# Altium schematic sheet ToF.SchDoc: My title
size A3; Organization: University of California; Address1: 475 Portola Plaza; Address2: Los Angeles, CA 90095; Revision: R01; SheetNumber: 1; SheetTotal: 1
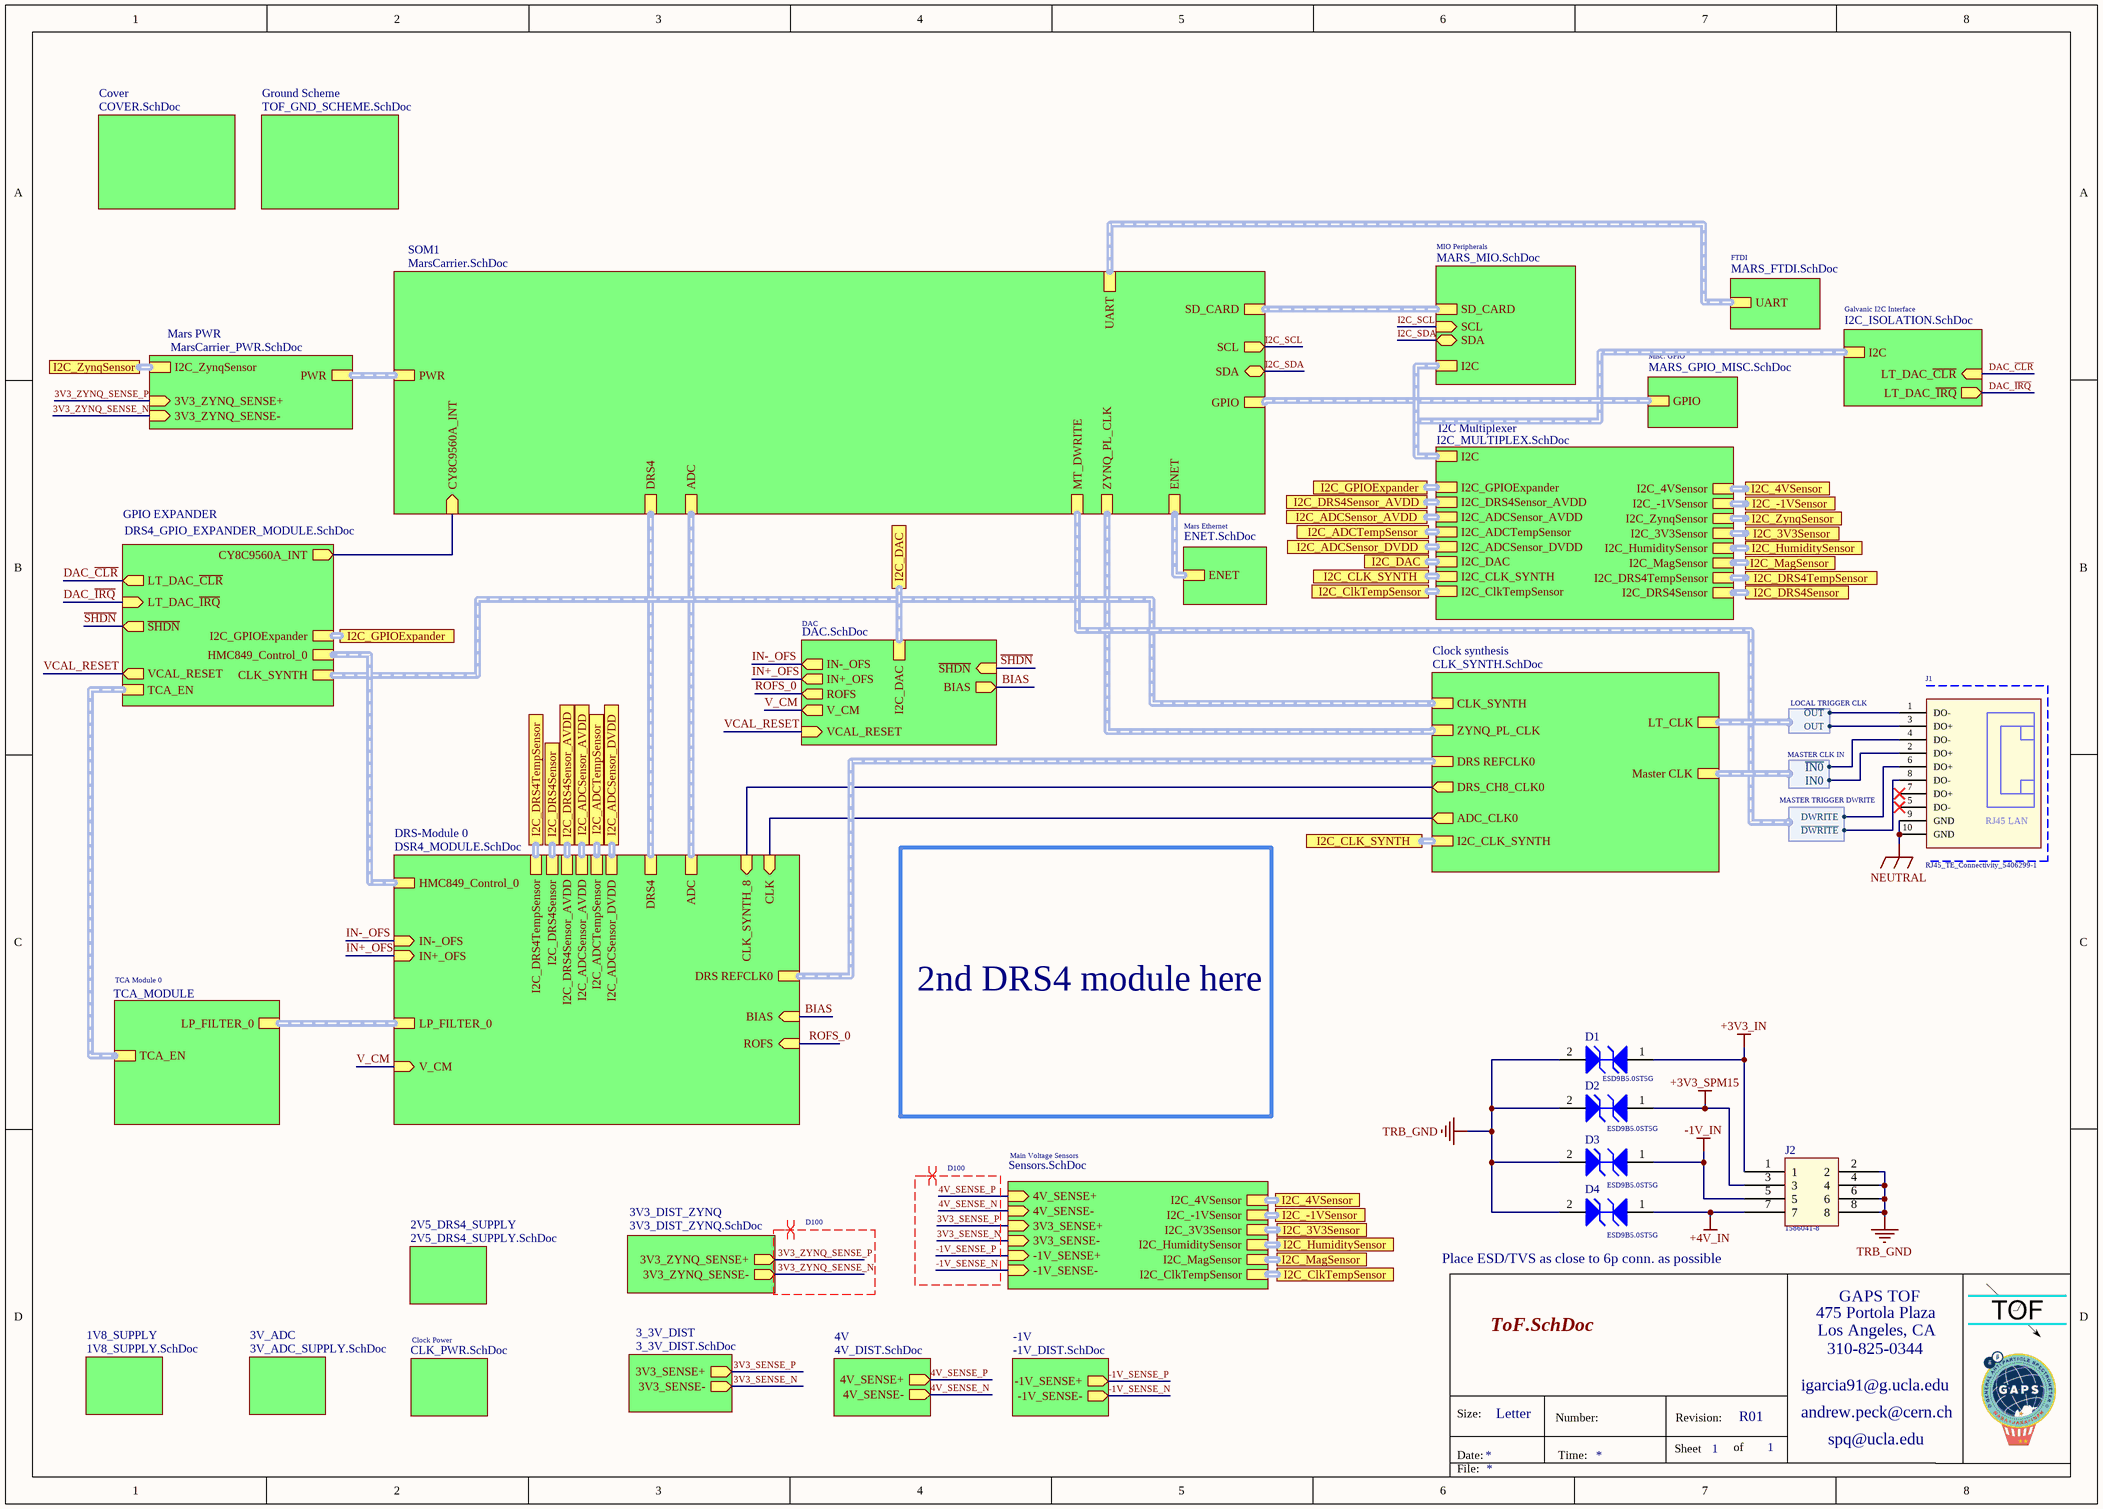
[diagram p0: ToF.SchDoc]

## Parts
D1  ESD9B5.0ST5G  [ONSC-SOD-923-2-514AB-01_V]
D2  ESD9B5.0ST5G  [ONSC-SOD-923-2-514AB-01_V]
D3  ESD9B5.0ST5G  [ONSC-SOD-923-2-514AB-01_V]
D4  ESD9B5.0ST5G  [ONSC-SOD-923-2-514AB-01_V]
J1  RJ45_TE_Connectivity_5406299-1  [RJ45_TE_Connectivity_5406299-1]
J2  Series: 1586041-8  [Header_TE_Connectivity_1586041-8_8POS]  (hidden comment: Header_TE_Connectivity_1586041-8_8POS)

## Sub-sheets
1V8_SUPPLY = 1V8_SUPPLY.SchDoc: no entries
2V5_DRS4_SUPPLY = 2V5_DRS4_SUPPLY.SchDoc: no entries
3_3V_DIST = 3_3V_DIST.SchDoc: 3V3_SENSE- (out), 3V3_SENSE+ (out)
3V3_DIST_ZYNQ = 3V3_DIST_ZYNQ.SchDoc: 3V3_ZYNQ_SENSE- (out), 3V3_ZYNQ_SENSE+ (out)
3V_ADC = 3V_ADC_SUPPLY.SchDoc: no entries
4V = 4V_DIST.SchDoc: 4V_SENSE- (out), 4V_SENSE+ (out)
-1V = -1V_DIST.SchDoc: -1V_SENSE- (out), -1V_SENSE+ (out)
Clock Power = CLK_PWR.SchDoc: no entries
Clock synthesis = CLK_SYNTH.SchDoc: CLK_SYNTH (harness CLK SYNTH CONTROL), ZYNQ_PL_CLK (harness ZYNQ PL CLK), DRS REFCLK0 (harness DRS4 REFCLK0), DRS_CH8_CLK0 (out), Master CLK (harness MASTER CLK IN), ADC_CLK0 (out), I2C_CLK_SYNTH (harness Clock Synth I2C), LT_CLK (harness LOCAL TRIGGER CLK)
Cover = COVER.SchDoc: no entries
DAC = DAC.SchDoc: I2C_DAC (harness DAC  I2C), IN-_OFS (out), IN+_OFS (out), ROFS (out), V_CM (out), VCAL_RESET (in), ~{SHDN} (in), BIAS (out)
DRS-Module 0 = DSR4_MODULE.SchDoc: ADC (harness ADC), DRS4 (harness DRS4), DRS REFCLK0 (harness DRS4 REFCLK 0), BIAS (in), ROFS (in), HMC849_Control_0 (harness HMC849 Control 0), LP_FILTER_0 (harness TCA Filter 0), V_CM (in), CLK_SYNTH_8 (in), IN-_OFS (in), IN+_OFS (in), CLK (in), I2C_DRS4TempSensor (harness Clk Synth Temp Sensor I2C), I2C_DRS4Sensor (harness DRS4 Current Sensor I2C), I2C_DRS4Sensor_AVDD (harness DRS4 Current Sensor I2C), I2C_ADCSensor_AVDD (harness ADC AVDD Current Sensor I2C), I2C_ADCTempSensor (harness ADC Temp Sensor I2C), I2C_ADCSensor_DVDD (harness ADC DVDD Current Sensor I2C)
FTDI = MARS_FTDI.SchDoc: UART (harness Mars UART)
Galvanic I2C Interface = I2C_ISOLATION.SchDoc: I2C (harness Mars I2C), LT_DAC_~{CLR} (in), LT_DAC_~{IRQ} (out)
GPIO EXPANDER = DRS4_GPIO_EXPANDER_MODULE.SchDoc: HMC849_Control_0 (harness HMC849 Control 0), CLK_SYNTH (harness CLK SYNTH CONTROL), TCA_EN (harness TCA EN), ~{SHDN} (out), VCAL_RESET (out), LT_DAC_~{CLR} (out), LT_DAC_~{IRQ} (in), CY8C9560A_INT (out), I2C_GPIOExpander (harness GPIO Expander I2C)
Ground Scheme = TOF_GND_SCHEME.SchDoc: no entries
I2C Multiplexer = I2C_MULTIPLEX.SchDoc: I2C (harness Mars I2C), I2C_4VSensor (harness 4V Current Sensor I2C), I2C_-1VSensor (harness -1V Current Sensor I2C), I2C_ZynqSensor (harness 3V3 Zynq Current Sensor I2C), I2C_3V3Sensor (harness 3V3 Current Sensor I2C), I2C_HumiditySensor (harness Humidity Sensor I2C), I2C_MagSensor (harness Magnetic Field Sensor I2C), I2C_DRS4TempSensor (harness DRS4 Temp Sensor I2C), I2C_DRS4Sensor (harness DRS4 Temp Sensor I2C), I2C_GPIOExpander (harness GPIO Expander I2C), I2C_DRS4Sensor_AVDD (harness DRS4 Current Sensor I2C), I2C_ADCSensor_AVDD (harness ADC AVDD Current Sensor I2C), I2C_ADCTempSensor (harness ADC Temp Sensor I2C), I2C_ADCSensor_DVDD (harness ADC DVDD Current Sensor I2C), I2C_DAC (harness DAC  I2C), I2C_CLK_SYNTH (harness Clock Synth I2C), I2C_ClkTempSensor (harness Clk Synth Temp Sensor I2C)
Main Voltage Sensors = Sensors.SchDoc: -1V_SENSE- (in), -1V_SENSE+ (in), 4V_SENSE- (in), 4V_SENSE+ (in), 3V3_SENSE- (in), 3V3_SENSE+ (in), I2C_4VSensor (harness 4V Current Sensor I2C), I2C_-1VSensor (harness -1V Current Sensor I2C), I2C_3V3Sensor (harness -1V Current Sensor I2C), I2C_HumiditySensor (harness -1V Current Sensor I2C), I2C_MagSensor (harness -1V Current Sensor I2C), I2C_ClkTempSensor (harness Clk Synth Temp Sensor I2C)
Mars Ethernet = ENET.SchDoc: ENET (harness Mars ENET)
Mars PWR = MarsCarrier_PWR.SchDoc: PWR (harness Mars Power), 3V3_ZYNQ_SENSE- (in), 3V3_ZYNQ_SENSE+ (in), I2C_ZynqSensor (harness -1V Current Sensor I2C)
MIO Peripherals = MARS_MIO.SchDoc: SD_CARD (harness Mars SD Card), SCL (in), SDA (bidir), I2C (harness Mars I2C)
Misc. GPIO = MARS_GPIO_MISC.SchDoc: GPIO (harness Misc. I/O)
SOM1 = MarsCarrier.SchDoc: ADC (harness ADC), DRS4 (harness DRS4), ZYNQ_PL_CLK (harness ZYNQ PL CLK), ENET (harness Mars ENET), SD_CARD (harness Mars SD Card), SCL (out), SDA (bidir), PWR (harness Mars Power), GPIO (harness Misc. I/O), UART (harness Mars UART), CY8C9560A_INT (in), MT_DWRITE (harness MASTER TRIGGER DWRITE)
TCA Module 0 = TCA_MODULE: LP_FILTER_0 (harness TCA Filter 0), TCA_EN (harness TCA EN)

## Ports
I2C_3V3Sensor (harness 3V3 Current Sensor I2C), I2C_4VSensor (harness 4V Current Sensor I2C), I2C_-1VSensor (harness -1V Current Sensor I2C), I2C_ADCSensor_AVDD (harness ADC AVDD Current Sensor I2C), I2C_ADCSensor_DVDD (harness ADC DVDD Current Sensor I2C), I2C_ADCTempSensor (harness ADC Temp Sensor I2C), I2C_CLK_SYNTH (harness Clock Synth I2C), I2C_ClkTempSensor (harness Clk Synth Temp Sensor I2C), I2C_DAC (harness DAC  I2C), I2C_DRS4Sensor (harness DRS4 Current Sensor I2C), I2C_DRS4Sensor_AVDD (harness DRS4 AVDD Current Sensor I2C), I2C_DRS4TempSensor (harness DRS4 Temp Sensor I2C), I2C_GPIOExpander (harness GPIO Expander I2C), I2C_HumiditySensor (harness Humidity Sensor I2C), I2C_MagSensor (harness Magnetic Field Sensor I2C), I2C_ZynqSensor (harness 3V3 Zynq Current Sensor I2C)

## Harnesses
MASTER CLK IN: IN0, ~{IN0}
LOCAL TRIGGER CLK: OUT, ~{OUT}
MASTER TRIGGER DWRITE: DWRITE, ~{DWRITE}

## Nets
+3V3_IN: D1.1(A1) J2.1
+3V3_SPM15: D2.1(A1) J2.3
+4V_IN: D4.1(A1) J2.7
-1V_IN: D3.1(A1) J2.5
NEUTRAL: J1.9(GND) J1.10(GND)
TRB_GND: D1.2(A2) D2.2(A2) D3.2(A2) D4.2(A2) J2.2 J2.4 J2.6 J2.8
3V3_SENSE_N: sheet 3_3V_DIST/3V3_SENSE-, sheet Main Voltage Sensors/3V3_SENSE-
3V3_SENSE_P: sheet 3_3V_DIST/3V3_SENSE+, sheet Main Voltage Sensors/3V3_SENSE+
3V3_ZYNQ_SENSE_N: sheet Mars PWR/3V3_ZYNQ_SENSE-, sheet 3V3_DIST_ZYNQ/3V3_ZYNQ_SENSE-
3V3_ZYNQ_SENSE_P: sheet Mars PWR/3V3_ZYNQ_SENSE+, sheet 3V3_DIST_ZYNQ/3V3_ZYNQ_SENSE+
4V_SENSE_N: sheet 4V/4V_SENSE-, sheet Main Voltage Sensors/4V_SENSE-
4V_SENSE_P: sheet 4V/4V_SENSE+, sheet Main Voltage Sensors/4V_SENSE+
-1V_SENSE_N: sheet -1V/-1V_SENSE-, sheet Main Voltage Sensors/-1V_SENSE-
-1V_SENSE_P: sheet -1V/-1V_SENSE+, sheet Main Voltage Sensors/-1V_SENSE+
BIAS: sheet DRS-Module 0/BIAS, sheet DAC/BIAS
DAC_~{CLR}: sheet GPIO EXPANDER/LT_DAC_~{CLR}, sheet Galvanic I2C Interface/LT_DAC_~{CLR}
DAC_~{IRQ}: sheet GPIO EXPANDER/LT_DAC_~{IRQ}, sheet Galvanic I2C Interface/LT_DAC_~{IRQ}
I2C_SCL: sheet SOM1/SCL, sheet MIO Peripherals/SCL
I2C_SDA: sheet SOM1/SDA, sheet MIO Peripherals/SDA
IN+_OFS: sheet DRS-Module 0/IN+_OFS, sheet DAC/IN+_OFS
IN-_OFS: sheet DRS-Module 0/IN-_OFS, sheet DAC/IN-_OFS
ROFS_0: sheet DRS-Module 0/ROFS, sheet DAC/ROFS
~{SHDN}: sheet DAC/~{SHDN}, sheet GPIO EXPANDER/~{SHDN}
V_CM: sheet DRS-Module 0/V_CM, sheet DAC/V_CM
VCAL_RESET: sheet DAC/VCAL_RESET, sheet GPIO EXPANDER/VCAL_RESET
NetJ1_1: J1.1(DO-) ; sheet Clock synthesis/LT_CLK.~{OUT}
NetJ1_2: J1.2(DO+) ; sheet Clock synthesis/Master CLK.IN0
NetJ1_3: J1.3(DO+) ; sheet Clock synthesis/LT_CLK.OUT
NetJ1_4: J1.4(DO-) ; sheet Clock synthesis/Master CLK.~{IN0}
NetJ1_6: J1.6(DO+) ; sheet SOM1/MT_DWRITE.DWRITE
NetJ1_8: J1.8(DO-) ; sheet SOM1/MT_DWRITE.~{DWRITE}
(unnamed): sheet DRS-Module 0/CLK_SYNTH_8, sheet Clock synthesis/DRS_CH8_CLK0
(unnamed): sheet DRS-Module 0/CLK, sheet Clock synthesis/ADC_CLK0
(unnamed): sheet SOM1/CY8C9560A_INT, sheet GPIO EXPANDER/CY8C9560A_INT

Not connected (* = marked no-connect by the designer): J1 5(DO-)* 7(DO+)*

## Buses and harness runs
harness port I2C_3V3Sensor = sheet I2C Multiplexer/I2C_3V3Sensor
harness port I2C_3V3Sensor = sheet Main Voltage Sensors/I2C_3V3Sensor
harness port I2C_4VSensor = sheet I2C Multiplexer/I2C_4VSensor
harness port I2C_4VSensor = sheet Main Voltage Sensors/I2C_4VSensor
harness port I2C_-1VSensor = sheet I2C Multiplexer/I2C_-1VSensor
harness port I2C_-1VSensor = sheet Main Voltage Sensors/I2C_-1VSensor
harness port I2C_ADCSensor_AVDD = sheet DRS-Module 0/I2C_ADCSensor_AVDD
harness port I2C_ADCSensor_AVDD = sheet I2C Multiplexer/I2C_ADCSensor_AVDD
harness port I2C_ADCSensor_DVDD = sheet DRS-Module 0/I2C_ADCSensor_DVDD
harness port I2C_ADCSensor_DVDD = sheet I2C Multiplexer/I2C_ADCSensor_DVDD
harness port I2C_ADCTempSensor = sheet DRS-Module 0/I2C_ADCTempSensor
harness port I2C_ADCTempSensor = sheet I2C Multiplexer/I2C_ADCTempSensor
harness port I2C_CLK_SYNTH = sheet Clock synthesis/I2C_CLK_SYNTH
harness port I2C_CLK_SYNTH = sheet I2C Multiplexer/I2C_CLK_SYNTH
harness port I2C_ClkTempSensor = sheet I2C Multiplexer/I2C_ClkTempSensor
harness port I2C_ClkTempSensor = sheet Main Voltage Sensors/I2C_ClkTempSensor
harness port I2C_DAC = sheet DAC/I2C_DAC
harness port I2C_DAC = sheet I2C Multiplexer/I2C_DAC
harness port I2C_DRS4Sensor = sheet DRS-Module 0/I2C_DRS4Sensor
harness port I2C_DRS4Sensor = sheet I2C Multiplexer/I2C_DRS4Sensor
harness port I2C_DRS4Sensor_AVDD = sheet DRS-Module 0/I2C_DRS4Sensor_AVDD
harness port I2C_DRS4Sensor_AVDD = sheet I2C Multiplexer/I2C_DRS4Sensor_AVDD
harness port I2C_DRS4TempSensor = sheet DRS-Module 0/I2C_DRS4TempSensor
harness port I2C_DRS4TempSensor = sheet I2C Multiplexer/I2C_DRS4TempSensor
harness port I2C_GPIOExpander = sheet GPIO EXPANDER/I2C_GPIOExpander
harness port I2C_GPIOExpander = sheet I2C Multiplexer/I2C_GPIOExpander
harness port I2C_HumiditySensor = sheet I2C Multiplexer/I2C_HumiditySensor
harness port I2C_HumiditySensor = sheet Main Voltage Sensors/I2C_HumiditySensor
harness port I2C_MagSensor = sheet I2C Multiplexer/I2C_MagSensor
harness port I2C_MagSensor = sheet Main Voltage Sensors/I2C_MagSensor
harness port I2C_ZynqSensor = sheet I2C Multiplexer/I2C_ZynqSensor
harness port I2C_ZynqSensor = sheet Mars PWR/I2C_ZynqSensor
harness sheet Clock synthesis/CLK_SYNTH = sheet GPIO EXPANDER/CLK_SYNTH
harness sheet Clock synthesis/DRS REFCLK0 = sheet DRS-Module 0/DRS REFCLK0
harness sheet Clock synthesis/ZYNQ_PL_CLK = sheet SOM1/ZYNQ_PL_CLK
harness sheet DRS-Module 0/ADC = sheet SOM1/ADC
harness sheet DRS-Module 0/DRS4 = sheet SOM1/DRS4
harness sheet DRS-Module 0/HMC849_Control_0 = sheet GPIO EXPANDER/HMC849_Control_0
harness sheet DRS-Module 0/LP_FILTER_0 = sheet TCA Module 0/LP_FILTER_0
harness sheet FTDI/UART = sheet SOM1/UART
harness sheet Galvanic I2C Interface/I2C = sheet I2C Multiplexer/I2C = sheet MIO Peripherals/I2C
harness sheet GPIO EXPANDER/TCA_EN = sheet TCA Module 0/TCA_EN
harness sheet Mars Ethernet/ENET = sheet SOM1/ENET
harness sheet Mars PWR/PWR = sheet SOM1/PWR
harness sheet MIO Peripherals/SD_CARD = sheet SOM1/SD_CARD
harness sheet Misc. GPIO/GPIO = sheet SOM1/GPIO

## Layout directives
differential pair; differential pair class D100: 3V3_SENSE_N, 3V3_SENSE_P, 3V3_ZYNQ_SENSE_N, 3V3_ZYNQ_SENSE_P, 4V_SENSE_N, 4V_SENSE_P, -1V_SENSE_N, -1V_SENSE_P

## Notes on the sheet
- 2nd DRS4 module here
- Place ESD/TVS as close to 6p conn. as possible
- 475 Portola Plaza
- GAPS TOF
- igarcia91@g.ucla.edu
- Los Angeles, CA
- 310-825-0344
- Size:
- Date:
- Letter
- Number:
- Time:
- Sheet
- Revision:
- of
- andrew.peck@cern.ch
- spq@ucla.edu
- File:
- (in symbol RJ45_TE_Connectivity_5406299-1) RJ45 LAN

## Library data of the parts
D1-D4 = ESD9B5.0ST5G: Transient Voltage Suppressor, Micro-Packaged Diode for ESD Protection, 2-Pin SOD-923, Pb-Free, Tape and Reel; Manufacturer: On Semiconductor; Direction: Bidirectional; VRWM Max (V): 5; V(BR) Min (V): 5.8; IR Max (uA): 1; ComponentLink1Description: Manufacturer URL; ComponentLink2Description: Datasheet; PartNumber: ESD9B5.0ST5G; ComponentLink3Description: Package Specification; PackageDescription: 2-Pin SOD, Body 0.8 x 0.6 mm; ComponentLink3URL: http://www.onsemi.com/pub_link/Collateral/514AB.PDF; DatasheetVersion: Rev. 2; ComponentLink1URL: http://www.onsemi.com/; PackageReference: SOD-923-2-514AB-01; Packing: Tape and Reel; PackageVersion: Rev. C, 03/2011; Mounting Technology: Surface Mount; Number of Lines: 1; ComponentLink2URL: http://www.onsemi.cn/pub_link/Collateral/ESD9B-D.PDF; RoHS: Pb-Free; Supplier 1: Mouser; Supplier Part Number 1: 863-ESD9B5.0ST5G
J1 = RJ45_TE_Connectivity_5406299-1: Modular Connectors / Ethernet Connectors 1 PORT CAT 5; Supplier 1: Mouser; Supplier Part Number 1: 571-5406299-1
J2 = Header_TE_Connectivity_1586041-8_8POS: Headers & Wire Housings RA HDR W/O PEGS 8P; Supplier Part Number 1: 571-15860418; Supplier 1: Mouser